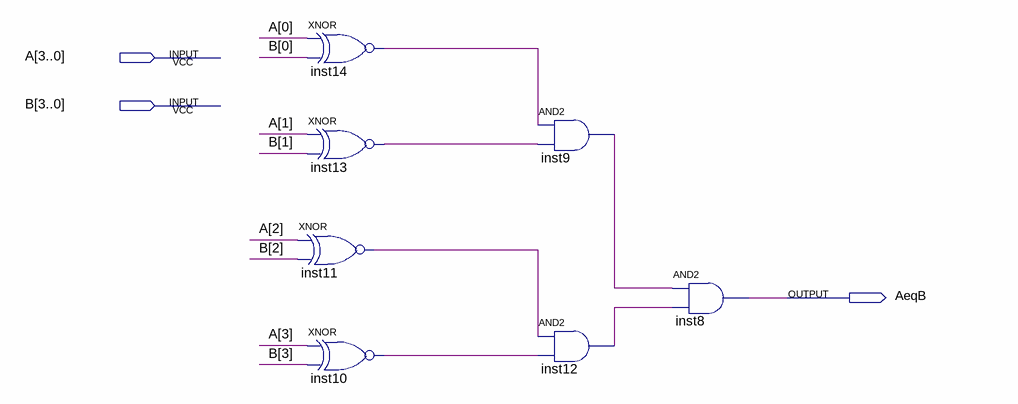
[diagram p0: schematic sheet]
// Quartus schematic G53_comp4.bdf as structural Verilog: 7 symbols, 3 pins
module G53_comp4 (
  input  [3:0] A,
  input  [3:0] B,
  output AeqB
);

  wire inst9_out, inst10_out, inst11_out, inst12_out, inst13_out, inst14_out;

  xnor inst14 (inst14_out, A[0], B[0]);
  xnor inst13 (inst13_out, A[1], B[1]);
  xnor inst11 (inst11_out, A[2], B[2]);
  xnor inst10 (inst10_out, A[3], B[3]);
  and inst9 (inst9_out, inst14_out, inst13_out);
  and inst12 (inst12_out, inst11_out, inst10_out);
  and inst8 (AeqB, inst9_out, inst12_out);
endmodule
